# Altium schematic sheet BSU_BQ796XX.SchDoc: BQ796XX
size A4; Version: 1.0; Sub Team: EEE; Module: BMS; Generation: NA; Organization: PERT; SheetNumber: 1; SheetTotal: 8
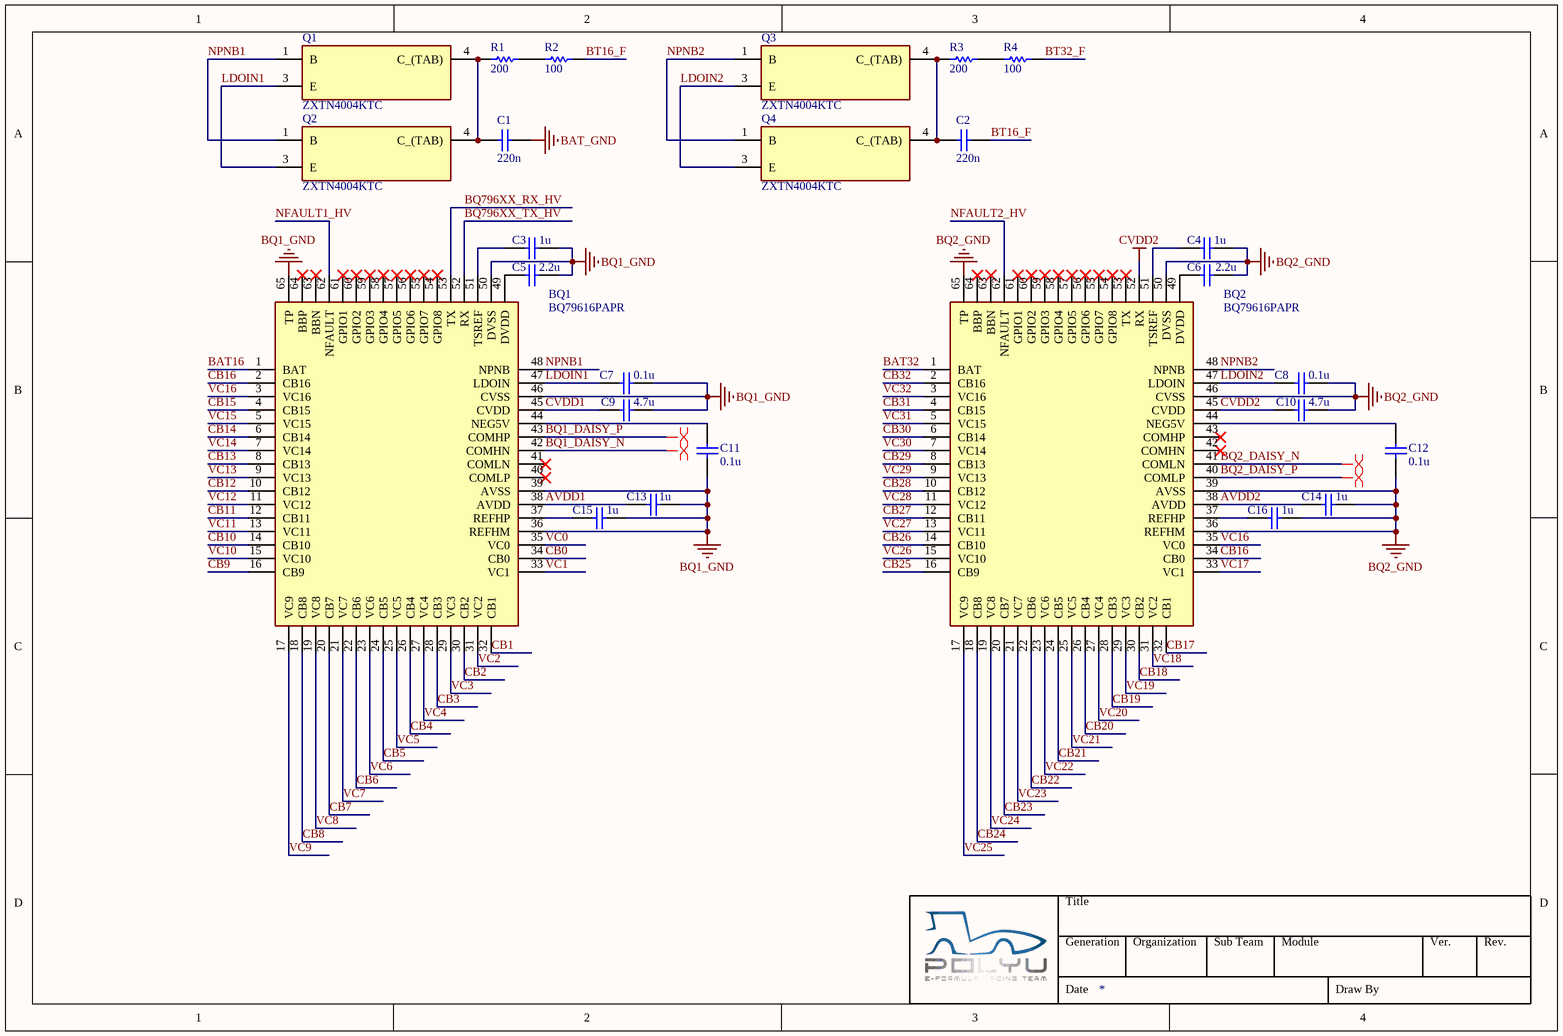
[diagram p0: BSU_BQ796XX.SchDoc]

## Parts
BQ1  BQ79616PAPR  [HTQFP65_BQ79616]
BQ2  BQ79616PAPR  [HTQFP65_BQ79616]
C1  220n  [1210_SMD_C]
C2  220n  [1210_SMD_C]
C3  1u  [0603_SMD_C]
C4  1u  [0603_SMD_C]
C5  2.2u  [0603_SMD_C]
C6  2.2u  [0603_SMD_C]
C7  0.1u  [0603_SMD_C]
C8  0.1u  [0603_SMD_C]
C9  4.7u  [0603_SMD_C]
C10  4.7u  [0603_SMD_C]
C11  0.1u  [0603_SMD_C]
C12  0.1u  [0603_SMD_C]
C13  1u  [0603_SMD_C]
C14  1u  [0603_SMD_C]
C15  1u  [0603_SMD_C]
C16  1u  [0603_SMD_C]
Q1  ZXTN4004KTC  [TO252-3_ZXTN4004K]
Q2  ZXTN4004KTC  [TO252-3_ZXTN4004K]
Q3  ZXTN4004KTC  [TO252-3_ZXTN4004K]
Q4  ZXTN4004KTC  [TO252-3_ZXTN4004K]
R1  200  [2010_SMD_R]
R2  100  [2010_SMD_R]
R3  200  [2010_SMD_R]
R4  100  [2010_SMD_R]

## Nets
BAT_GND: C1.2
BQ1_GND: BQ1.36(REFHM) BQ1.39(AVSS) BQ1.46(CVSS) BQ1.50(DVSS) BQ1.65(TP) C3.2 C5.2 C7.1 C9.2 C11.1 C13.1 C15.1
BQ2_GND: BQ2.36(REFHM) BQ2.39(AVSS) BQ2.46(CVSS) BQ2.50(DVSS) BQ2.65(TP) C4.2 C6.2 C8.1 C10.2 C12.1 C14.1 C16.1
CVDD2: BQ2.45(CVDD) BQ2.52(RX) C10.1
AVDD1: BQ1.38(AVDD) C13.2
AVDD2: BQ2.38(AVDD) C14.2
BAT16: BQ1.1(BAT)
BAT32: BQ2.1(BAT)
BQ1_DAISY_N: BQ1.42(COMHN)
BQ1_DAISY_P: BQ1.43(COMHP)
BQ2_DAISY_N: BQ2.41(COMLN)
BQ2_DAISY_P: BQ2.40(COMLP)
BQ796XX_RX_HV: BQ1.53(TX)
BQ796XX_TX_HV: BQ1.52(RX)
BT16_F: C2.2 R2.2
BT32_F: R4.2
CB0: BQ1.34(CB0)
CB1: BQ1.32(CB1)
CB2: BQ1.30(CB2)
CB3: BQ1.28(CB3)
CB4: BQ1.26(CB4)
CB5: BQ1.24(CB5)
CB6: BQ1.22(CB6)
CB7: BQ1.20(CB7)
CB8: BQ1.18(CB8)
CB9: BQ1.16(CB9)
CB10: BQ1.14(CB10)
CB11: BQ1.12(CB11)
CB12: BQ1.10(CB12)
CB13: BQ1.8(CB13)
CB14: BQ1.6(CB14)
CB15: BQ1.4(CB15)
CB16: BQ1.2(CB16) BQ2.34(CB0)
CB17: BQ2.32(CB1)
CB18: BQ2.30(CB2)
CB19: BQ2.28(CB3)
CB20: BQ2.26(CB4)
CB21: BQ2.24(CB5)
CB22: BQ2.22(CB6)
CB23: BQ2.20(CB7)
CB24: BQ2.18(CB8)
CB25: BQ2.16(CB9)
CB26: BQ2.14(CB10)
CB27: BQ2.12(CB11)
CB28: BQ2.10(CB12)
CB29: BQ2.8(CB13)
CB30: BQ2.6(CB14)
CB31: BQ2.4(CB15)
CB32: BQ2.2(CB16)
CVDD1: BQ1.45(CVDD) C9.1
LDOIN1: BQ1.47(LDOIN) C7.2 Q1.3(E) Q2.3(E)
LDOIN2: BQ2.47(LDOIN) C8.2 Q3.3(E) Q4.3(E)
NFAULT1_HV: BQ1.62(NFAULT)
NFAULT2_HV: BQ2.62(NFAULT)
NPNB1: BQ1.48(NPNB) Q1.1(B) Q2.1(B)
NPNB2: BQ2.48(NPNB) Q3.1(B) Q4.1(B)
VC0: BQ1.35(VC0)
VC1: BQ1.33(VC1)
VC2: BQ1.31(VC2)
VC3: BQ1.29(VC3)
VC4: BQ1.27(VC4)
VC5: BQ1.25(VC5)
VC6: BQ1.23(VC6)
VC7: BQ1.21(VC7)
VC8: BQ1.19(VC8)
VC9: BQ1.17(VC9)
VC10: BQ1.15(VC10)
VC11: BQ1.13(VC11)
VC12: BQ1.11(VC12)
VC13: BQ1.9(VC13)
VC14: BQ1.7(VC14)
VC15: BQ1.5(VC15)
VC16: BQ1.3(VC16) BQ2.35(VC0)
VC17: BQ2.33(VC1)
VC18: BQ2.31(VC2)
VC19: BQ2.29(VC3)
VC20: BQ2.27(VC4)
VC21: BQ2.25(VC5)
VC22: BQ2.23(VC6)
VC23: BQ2.21(VC7)
VC24: BQ2.19(VC8)
VC25: BQ2.17(VC9)
VC26: BQ2.15(VC10)
VC27: BQ2.13(VC11)
VC28: BQ2.11(VC12)
VC29: BQ2.9(VC13)
VC30: BQ2.7(VC14)
VC31: BQ2.5(VC15)
VC32: BQ2.3(VC16)
NetBQ1_37: BQ1.37(REFHP) C15.2
NetBQ1_44: BQ1.44(NEG5V) C11.2
NetBQ1_49: BQ1.49(DVDD) C5.1
NetBQ1_51: BQ1.51(TSREF) C3.1
NetBQ2_37: BQ2.37(REFHP) C16.2
NetBQ2_44: BQ2.44(NEG5V) C12.2
NetBQ2_49: BQ2.49(DVDD) C6.1
NetBQ2_51: BQ2.51(TSREF) C4.1
NetC1_1: C1.1 Q1.4(C_(TAB)) Q2.4(C_(TAB)) R1.1
NetC2_1: C2.1 Q3.4(C_(TAB)) Q4.4(C_(TAB)) R3.1
NetR1_2: R1.2 R2.1
NetR3_2: R3.2 R4.1

Not connected (* = marked no-connect by the designer): BQ1 40(COMLP)* 41(COMLN)* 54(GPIO8)* 55(GPIO7)* 56(GPIO6)* 57(GPIO5)* 58(GPIO4)* 59(GPIO3)* 60(GPIO2)* 61(GPIO1)* 63(BBN)* 64(BBP)*; BQ2 42(COMHN)* 43(COMHP)* 53(TX)* 54(GPIO8)* 55(GPIO7)* 56(GPIO6)* 57(GPIO5)* 58(GPIO4)* 59(GPIO3)* 60(GPIO2)* 61(GPIO1)* 63(BBN)* 64(BBP)*

## Layout directives
differential pair: BQ1_DAISY_N, BQ1_DAISY_P, BQ2_DAISY_N, BQ2_DAISY_P

## Notes on the sheet
- Title
- Generation
- Organization
- Sub Team
- Module
- Ver.
- Rev.
- Date
- Draw By

## Library data of the parts
BQ1 BQ2 = BQ79616PAPR: Battery Management 16-S precision battery monitor, balancer and integrated protector with stacking interface; Manufacturer_Name: Texas Instruments; Geometry.Height: 1.2mm; Mouser Part Number: 595-BQ79616PAPR; Mouser Price/Stock: https://www.mouser.co.uk/ProductDetail/Texas-Instruments/BQ79616PAPR?qs=1Kr7Jg1SGW8FUVDCFv5r0A%3D%3D; Manufacturer_Part_Number: BQ79616PAPR; Datasheet Link: https://www.ti.com/lit/ds/symlink/bq79616.pdf?ts=1694396292843&ref_url=https%253A%252F%252Fwww.ti.com%252Fproduct%252Fzh-tw%252FBQ79616
C1 C2 = 1210_SMD_Capacitor: 1210 SMD Capacitor; Voltage Rating: 100VDC; Tolerance: *; Dielectric: *; Value: 220n
C3-C16 = 0603_SMD_Capacitor: 0603 SMD Capacitor; Voltage Rating: 10VDC; Tolerance: *; Dielectric: *
  C3 C4 C13-C16: Value: 1u
  C5 C6: Value: 2.2u
  C7 C8 C11 C12: Value: 0.1u
  C9 C10: Value: 4.7u
Q1-Q4 = ZXTN4004KTC: Transistor; Manufacturer_Name: Diodes Incorporated; Datasheet Link: https://datasheet.datasheetarchive.com/originals/distributors/Datasheets-DGA18/1088694.pdf; Height: 2.39mm; Manufacturer_Part_Number: ZXTN4004KTC; Mouser Part Number: 621-ZXTN4004KTC; Mouser Price/Stock: https://www.mouser.co.uk/ProductDetail/Diodes-Incorporated/ZXTN4004KTC?qs=aXnpsjvrXd1NjskJTVsVYA%3D%3D; Arrow Part Number: ZXTN4004KTC; Arrow Price/Stock: https://www.arrow.com/en/products/zxtn4004ktc/diodes-incorporated?region=asia
R1-R4 = 2010_SMD_Resistor: 2010 SMD Resistor; Tolerance: *; Power Rating: *; Temperature Coefficient: *
  R1 R3: Value: 200
  R2 R4: Value: 100